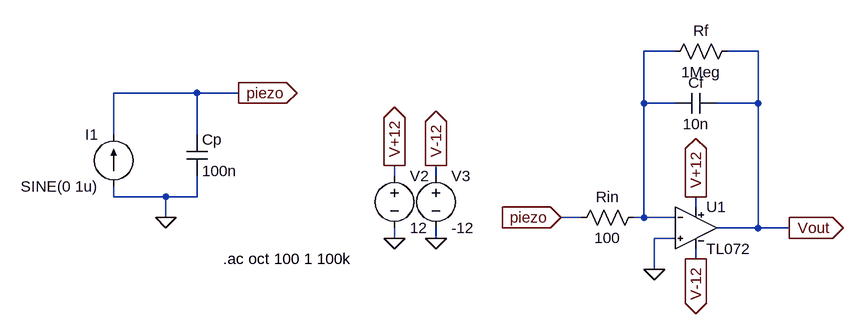
[diagram p0: schematic piezo.asc]
piezo.asc, the LTspice schematic file:
Version 4
SHEET 1 880 788
WIRE 432 -64 384 -64
WIRE 560 -64 512 -64
WIRE -304 0 -432 0
WIRE -240 0 -304 0
WIRE 384 16 384 -64
WIRE 432 16 384 16
WIRE 560 16 560 -64
WIRE 560 16 496 16
WIRE -432 64 -432 0
WIRE -304 64 -304 0
WIRE 0 128 0 112
WIRE 64 128 64 112
WIRE -432 160 -432 144
WIRE -352 160 -432 160
WIRE -304 160 -304 128
WIRE -304 160 -352 160
WIRE 464 176 464 160
WIRE -352 192 -352 160
WIRE 288 192 256 192
WIRE 384 192 384 16
WIRE 384 192 368 192
WIRE 432 192 384 192
WIRE 560 208 560 16
WIRE 560 208 496 208
WIRE 608 208 560 208
WIRE 0 224 0 208
WIRE 64 224 64 208
WIRE 432 224 400 224
WIRE 464 256 464 240
WIRE 400 272 400 224
FLAG 0 224 0
FLAG 64 224 0
FLAG 0 112 V+12
IOPIN 0 112 Out
FLAG 64 112 V-12
IOPIN 64 112 Out
FLAG 464 256 V-12
IOPIN 464 256 Out
FLAG 464 160 V+12
IOPIN 464 160 Out
FLAG 608 208 Vout
IOPIN 608 208 Out
FLAG 256 192 piezo
IOPIN 256 192 In
FLAG -240 0 piezo
IOPIN -240 0 Out
FLAG -352 192 0
FLAG 400 272 0
SYMBOL voltage 0 112 R0
SYMATTR InstName V2
SYMATTR Value 12
SYMBOL voltage 64 112 R0
SYMATTR InstName V3
SYMATTR Value -12
SYMBOL Res 528 -80 R90
WINDOW 0 0 56 VBottom 2
WINDOW 3 32 56 VTop 2
SYMATTR InstName Rf
SYMATTR Value 1Meg
SYMBOL Cap 496 0 R90
WINDOW 0 0 32 VBottom 2
WINDOW 3 32 32 VTop 2
SYMATTR InstName Cf
SYMATTR Value 10n
SYMBOL Res 384 176 R90
WINDOW 0 0 56 VBottom 2
WINDOW 3 32 56 VTop 2
SYMATTR InstName Rin
SYMATTR Value 100
SYMBOL current -432 144 R180
WINDOW 0 24 80 Left 2
WINDOW 3 24 0 Left 2
SYMATTR InstName I1
SYMATTR Value SINE(0 1u)
SYMATTR Value2 AC 1u
SYMBOL Cap -320 64 R0
SYMATTR InstName Cp
SYMATTR Value 100n
SYMBOL TL072 464 144 R0
SYMATTR InstName U1
TEXT -264 256 Left 2 !.ac oct 100 1 100k

The netlist it stands for:
* piezo.asc
V2 V+12 0 12
V3 V-12 0 -12
Rf Vout N001 1Meg
Cf Vout N001 10n
Rin N001 piezo 100
I1 0 piezo SINE(0 1u) AC 1u
Cp piezo 0 100n
XU1 0 N001 V+12 V-12 Vout TL072  ; pins In+ In- V+ V- OUT
.ac oct 100 1 100k
.lib TL072.sub
.backanno
.end